# Altium schematic sheet MotorControl.SchDoc
size Letter
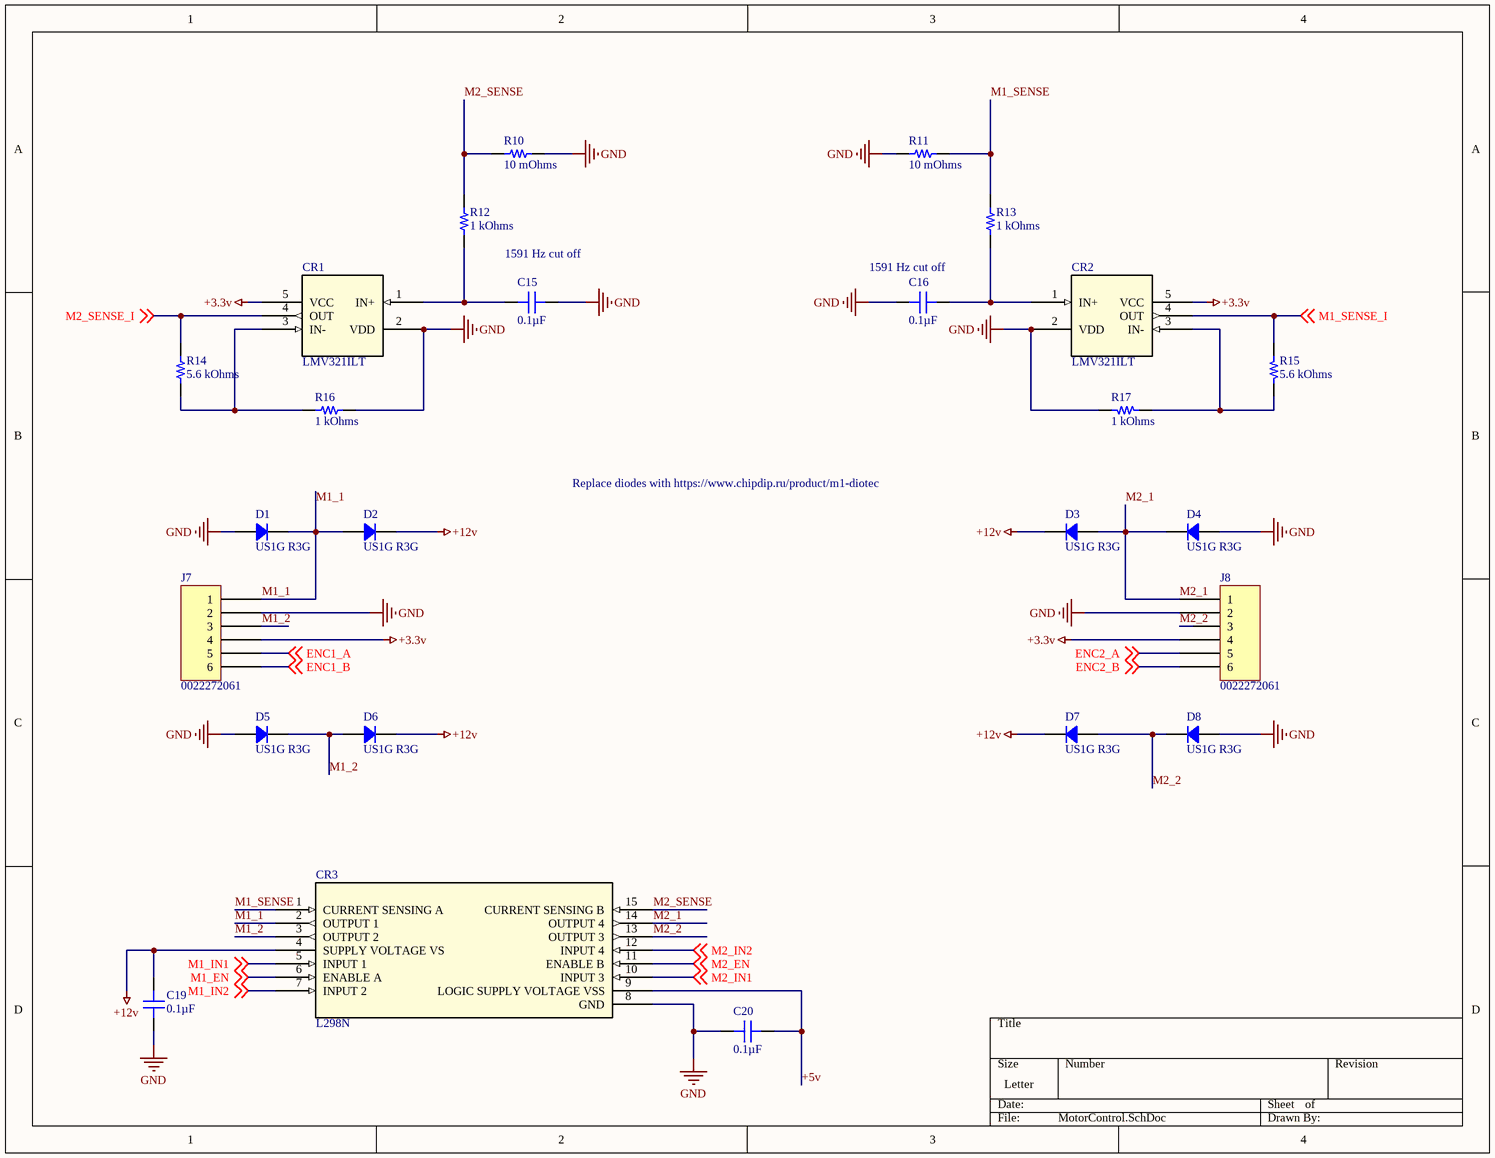
[diagram p0: MotorControl.SchDoc]

## Parts
C15  0.1µF  [CAP 0805_2012]
C16  0.1µF  [CAP 0805_2012]
C19  0.1µF  [CAP 0805_2012]
C20  0.1µF  [CAP 0805_2012]
CR1  LMV321ILT  [SOT23-5_STM]
CR2  LMV321ILT  [SOT23-5_STM]
CR3  L298N  [Multiwatt15_V_STM]
D1  US1G R3G  [DO214AC SMA]
D2  US1G R3G  [DO214AC SMA]
D3  US1G R3G  [DO214AC SMA]
D4  US1G R3G  [DO214AC SMA]
D5  US1G R3G  [DO214AC SMA]
D6  US1G R3G  [DO214AC SMA]
D7  US1G R3G  [DO214AC SMA]
D8  US1G R3G  [DO214AC SMA]
J7  0022272061  [MOLEX KK 0022272061]
J8  0022272061  [MOLEX KK 0022272061]
R10  10 mOhms  [RES 1206_3216]
R11  10 mOhms  [RES 1206_3216]
R12  1 kOhms  [RES 0805_2012]
R13  1 kOhms  [RES 0805_2012]
R14  5.6 kOhms  [RES 0805_2012]
R15  5.6 kOhms  [RES 0805_2012]
R16  1 kOhms  [RES 0805_2012]
R17  1 kOhms  [RES 0805_2012]

## Nets
+3.3v: CR1.5(VCC) CR2.5(VCC) J7.4 J8.4
+12v: C19.2 CR3.4(SUPPLY_VOLTAGE_VS) D2.2 D3.2 D6.2 D7.2
GND: C15.2 C16.1 C19.1 C20.1 CR1.2(VDD) CR2.2(VDD) CR3.8(GND) D1.1 D4.1 D5.1 D8.1 J7.2 J8.2 R10.2 R11.1 R16.2 R17.2
+5v: C20.2 CR3.9(LOGIC_SUPPLY_VOLTAGE_VSS)
ENC1_A: J7.5 ; off-sheet ENC1_A
ENC1_B: J7.6 ; off-sheet ENC1_B
ENC2_A: J8.5 ; off-sheet ENC2_A
ENC2_B: J8.6 ; off-sheet ENC2_B
M1_1: CR3.2(OUTPUT_1) D1.2 D2.1 J7.1
M1_2: CR3.3(OUTPUT_2) D5.2 D6.1 J7.3
M1_EN: CR3.6(ENABLE_A) ; off-sheet M1_EN
M1_IN1: CR3.5(INPUT_1) ; off-sheet M1_IN1
M1_IN2: CR3.7(INPUT_2) ; off-sheet M1_IN2
M1_SENSE: CR3.1(CURRENT_SENSING_A) R11.2 R13.2
M1_SENSE_I: CR2.4(OUT) R15.2 ; off-sheet M1_SENSE_I
M2_1: CR3.14(OUTPUT_4) D3.1 D4.2 J8.1
M2_2: CR3.13(OUTPUT_3) D7.1 D8.2 J8.3
M2_EN: CR3.11(ENABLE_B) ; off-sheet M2_EN
M2_IN1: CR3.10(INPUT_3) ; off-sheet M2_IN1
M2_IN2: CR3.12(INPUT_4) ; off-sheet M2_IN2
M2_SENSE: CR3.15(CURRENT_SENSING_B) R10.1 R12.2
M2_SENSE_I: CR1.4(OUT) R14.2 ; off-sheet M2_SENSE_I
NetC15_1: C15.1 CR1.1(IN+) R12.1
NetC16_2: C16.2 CR2.1(IN+) R13.1
NetCR1_3: CR1.3(IN-) R14.1 R16.1
NetCR2_3: CR2.3(IN-) R15.1 R17.1

## Notes on the sheet
- 1591 Hz cut off
- Replace diodes with https://www.chipdip.ru/product/m1-diotec

## Library data of the parts
C15 C16 = VJ0805V104ZXJCW1BC: CAP CER 0.1UF 16V Y5V 0805; Manufacturer: Vishay Vitramon; Temperature Coefficient: Y5V (F); Tolerance: -20%, +80%; Part Number: VJ0805V104ZXJCW1BC; Value: 0.1µF; Applications: General Purpose; Capacitance: 0.1µF; ComponentLink1Description: Datasheet; ComponentLink1URL: https://www.vishay.com/docs/28548/vjw1bcbascomseries.pdf; ComponentLink2Description: DigiKey Link; ComponentLink2URL: http://digikey.com/product-detail/en/vishay-vitramon/VJ0805V104ZXJCW1BC/720-1731-1-ND/8324151; Device Package: 0805 (2012 Metric); LastUpdated: 9/2/2020 1:04:40 AM; Lifecycle Status: Active; Minimum Order: 1; Mounting Type: Surface Mount, MLCC; Operating Temperature: -25°C ~ 85°C; Package / Case: 0805 (2012 Metric); Packaging: TapeAndReel; PartId: 3674; Part Status: Active; Price: 0.04; Series: VJ; Size / Dimension: 0.079" L x 0.049" W (2.00mm x 1.25mm); Supplier 1: DigiKey; Supplier Part Number 1: 720-1731-1-ND; Thickness (Max): 0.028" (0.70mm); Voltage - Rated: 16V
C19 C20 = CC0805MRX7R9BB104: CAP CER 0.1UF 50V X7R 0805; Manufacturer: Yageo; Tolerance: ±20%; Part Number: CC0805MRX7R9BB104; Value: 0.1µF; Applications: General Purpose; Capacitance: 0.1µF; ComponentLink1Description: Datasheet; ComponentLink1URL: https://www.yageo.com/upload/media/product/productsearch/datasheet/mlcc/UPY-GPHC_X7R_6.3V-to-50V_18.pdf; ComponentLink2Description: DigiKey Link; ComponentLink2URL: http://digikey.com/product-detail/en/yageo/CC0805MRX7R9BB104/311-4351-1-ND/8025440; Device Package: 0805 (2012 Metric); LastUpdated: 9/2/2020 1:04:42 AM; Lifecycle Status: Active; Minimum Order: 1; Mounting Type: Surface Mount, MLCC; Operating Temperature: -55°C ~ 125°C; Package / Case: 0805 (2012 Metric); Packaging: TapeAndReel; PartId: 2475; Part Status: Active; Price: 0.02; Series: CC; Size / Dimension: 0.079" L x 0.049" W (2.00mm x 1.25mm); Supplier 1: DigiKey; Supplier Part Number 1: 311-4351-1-ND; Temperature Coefficient: X7R; Thickness (Max): 0.037" (0.95mm); Voltage - Rated: 50V
CR1 CR2 = LMV321ILT: No Description Available; SourceLibrary: Update_to_database_2020-12-04; Built_By: EMA_UL_Team; Vendor: STMicroelectronics; Type: DEV; Manufacturer_Part_Number: LMV321ILT; Copyright: Copyright (C) 2018 Accelerated Designs. All rights reserved; RefDes: RefDes
CR3 = L298N: No Description Available; SourceLibrary: Updates_to_database_2020-11-02; Built_By: EMA_UL_Team; Vendor: STMicroelectronics; Type: DEV; Manufacturer_Part_Number: L298N; Copyright: Copyright (C) 2018 Accelerated Designs. All rights reserved; RefDes: RefDes
D1-D8 = US1G R3G: DIODE GEN PURP 400V 1A DO214AC; Manufacturer: Taiwan Semiconductor Corporation; Capacitance @ Vr, F: 15pF @ 4V, 1MHz; Current - Reverse Leakage @ Vr: 5µA @ 400V; Diode Type: Standard; Reverse Recovery Time (trr): 50ns; Speed: Fast Recovery =< 500ns, > 200mA (Io); Voltage - Forward (Vf) (Max) @ If: 1V @ 1A; Part Number: US1G R3G; ComponentLink1Description: Datasheet; ComponentLink1URL: https://www.taiwansemi.com/products/datasheet/US1A%20SERIES_M15.pdf; ComponentLink2Description: DigiKey Link; ComponentLink2URL: http://digikey.com/product-detail/en/taiwan-semiconductor-corporation/US1G-R3G/US1GR3GCT-ND/7360843; Current - Average Rectified (Io): 1A; LastUpdated: 9/2/2020 1:19:02 AM; Lifecycle Status: Active; Minimum Order: 1; Mounting Type: Surface Mount; Operating Temperature - Junction: -55°C ~ 150°C; Package / Case: DO-214AC, SMA; Packaging: TapeAndReel; PartId: 930; Part Status: Active; Price: 0.09; Series: -; Supplier 1: DigiKey; Supplier Part Number 1: US1GR3GCT-ND; Supplier Device Package: DO-214AC (SMA); Voltage - DC Reverse (Vr) (Max): 400V
J7 J8 = 0022272061: CONN HEADER VERT 6POS 2.54MM; Manufacturer: Molex; Contact Length - Mating: 0.295" (7.49mm); Contact Length - Post: 0.140" (3.56mm); Material Flammability Rating: UL94 V-0; Number of Positions: 6; Number of Positions Loaded: All; Overall Contact Length: 0.560" (14.22mm); Pitch - Mating: 0.100" (2.54mm); Shrouding: Shrouded - 1 Wall; Style: Board to Cable/Wire; Part Number: 0022272061; ComponentLink1Description: Datasheet; ComponentLink1URL: https://www.molex.com/pdm_docs/sd/022272061_sd.pdf; ComponentLink2Description: DigiKey Link; ComponentLink2URL: http://digikey.com/product-detail/en/molex/0022272061/WM4115-ND/1130581; Connector Type: Header; Contact Finish - Mating: Tin; Contact Finish - Post: Tin; Contact Finish Thickness - Mating: 100.0µin (2.54µm); Contact Material: Brass; Contact Shape: Square; Contact Type: Male Pin; Fastening Type: Friction Lock; Insulation Color: Natural; Insulation Height: 0.461" (11.70mm); Insulation Material: Polyamide (PA), Nylon; LastUpdated: 1/12/2020 11:52:24 PM; Lifecycle Status: Active; Minimum Order: 1; Mounting Type: Through Hole; Number of Rows: 1; Packaging: Bulk; PartId: 80; Part Status: Active; Price: 0.49; Series: KK 6410; Supplier 1: DigiKey; Supplier Part Number 1: WM4115-ND; Termination: Solder
R10 R11 = LVT12R0100FER: RES 0.01 OHM 1% 1W 1206; Manufacturer: Ohmite; Temperature Coefficient: ±75ppm/°C; Part Number: LVT12R0100FER; ComponentLink1Description: Datasheet; ComponentLink1URL: https://www.ohmite.com/assets/docs/res_lvt.pdf?r=false; ComponentLink2Description: DigiKey Link; ComponentLink2URL: http://digikey.com/product-detail/en/ohmite/LVT12R0100FER/LVT12R0100FERCT-ND/9556182; Composition: Metal Element; Device Package: 1206 (3216 Metric); Features: Current Sense; Height - Seated (Max): 0.026" (0.65mm); LastUpdated: 9/2/2020 1:12:33 AM; Lifecycle Status: Active; Minimum Order: 1; Number of Terminations: 2; Operating Temperature: -55°C ~ 155°C; Package / Case: 1206 (3216 Metric); Packaging: TapeAndReel; PartId: 42343; Part Status: Active; Power (Watts): 1W; Price: 0.07; Resistance: 10 mOhms; Series: LVT; Size / Dimension: 0.126" L x 0.063" W (3.20mm x 1.60mm); Supplier 1: DigiKey; Supplier Part Number 1: LVT12R0100FERCT-ND; Supplier Device Package: 1206; Tolerance: ±1%; Value: 10 mOhms
R12 R13 = RN73R2ATTD1001F50: RES 1K OHM 1% 1/8W 0805; Manufacturer: KOA Speer Electronics, Inc.; Power (Watts): 0.125W, 1/8W; Temperature Coefficient: ±50ppm/°C; Part Number: RN73R2ATTD1001F50; Value: 1 kOhms; ComponentLink1Description: Datasheet; ComponentLink1URL: //media.digikey.com/pdf/Data%20Sheets/KOA%20Speer/RN73R_Type_DS.pdf; ComponentLink2Description: DigiKey Link; ComponentLink2URL: http://digikey.com/product-detail/en/koa-speer-electronics-inc/RN73R2ATTD1001F50/2019-RN73R2ATTD1001F50CT-ND/11476952; Composition: Metal Film; Device Package: 0805 (2012 Metric); Features: Moisture Resistant; LastUpdated: 9/2/2020 1:14:23 AM; Lifecycle Status: Active; Minimum Order: 1; Number of Terminations: 2; Operating Temperature: -55°C ~ 155°C; Package / Case: 0805 (2012 Metric); Packaging: TapeAndReel; PartId: 50101; Part Status: Active; Price: 0.06; Resistance: 1 kOhms; Series: RN73R; Supplier 1: DigiKey; Supplier Part Number 1: 2019-RN73R2ATTD1001F50CT-ND; Supplier Device Package: 0805; Tolerance: ±1%
R14 R15 = ERJ-6ENF5601V: RES SMD 5.6K OHM 1% 1/8W 0805; Manufacturer: Panasonic Electronic Components; Power (Watts): 0.125W, 1/8W; Temperature Coefficient: ±100ppm/°C; Part Number: ERJ-6ENF5601V; Value: 5.6 kOhms; ComponentLink1Description: Datasheet; ComponentLink1URL: https://industrial.panasonic.com/cdbs/www-data/pdf/RDA0000/AOA0000C304.pdf; ComponentLink2Description: DigiKey Link; ComponentLink2URL: http://digikey.com/product-detail/en/panasonic-electronic-components/ERJ-6ENF5601V/P5.60KCCT-ND/1746882; Composition: Thick Film; Device Package: 0805 (2012 Metric); Features: Automotive AEC-Q200; Height - Seated (Max): 0.028" (0.70mm); LastUpdated: 9/2/2020 1:15:09 AM; Lifecycle Status: Active; Minimum Order: 1; Number of Terminations: 2; Operating Temperature: -55°C ~ 155°C; Package / Case: 0805 (2012 Metric); Packaging: TapeAndReel; PartId: 34762; Part Status: Active; Price: 0.01; Ratings: AEC-Q200; Resistance: 5.6 kOhms; Series: ERJ; Size / Dimension: 0.079" L x 0.049" W (2.00mm x 1.25mm); Supplier 1: DigiKey; Supplier Part Number 1: P5.60KCCT-ND; Supplier Device Package: 0805; Tolerance: ±1%
R16 R17 = CRCW08051K00FKEA: RES SMD 1K OHM 1% 1/8W 0805; Manufacturer: Vishay Dale; Power (Watts): 0.125W, 1/8W; Temperature Coefficient: ±100ppm/°C; Part Number: CRCW08051K00FKEA; Value: 1 kOhms; ComponentLink1Description: Datasheet; ComponentLink1URL: http://www.vishay.com/docs/20035/dcrcwe3.pdf; ComponentLink2Description: DigiKey Link; ComponentLink2URL: http://digikey.com/product-detail/en/vishay-dale/CRCW08051K00FKEA/541-1.00KCCT-ND/1180783; Composition: Thick Film; Device Package: 0805 (2012 Metric); Features: Automotive AEC-Q200; Height - Seated (Max): 0.020" (0.50mm); LastUpdated: 9/2/2020 1:15:23 AM; Lifecycle Status: Active; Minimum Order: 1; Number of Terminations: 2; Operating Temperature: -55°C ~ 155°C; Package / Case: 0805 (2012 Metric); Packaging: TapeAndReel; PartId: 28103; Part Status: Active; Price: 0.01; Ratings: AEC-Q200; Resistance: 1 kOhms; Series: CRCW; Size / Dimension: 0.079" L x 0.049" W (2.00mm x 1.25mm); Supplier 1: DigiKey; Supplier Part Number 1: 541-1.00KCCT-ND; Supplier Device Package: 0805; Tolerance: ±1%